# Altium schematic sheet Rail_1.SchDoc: Half Bridge 1
size A4; DocumentNumber: 3; Revision: 1.1; SheetNumber: 3; SheetTotal: 6
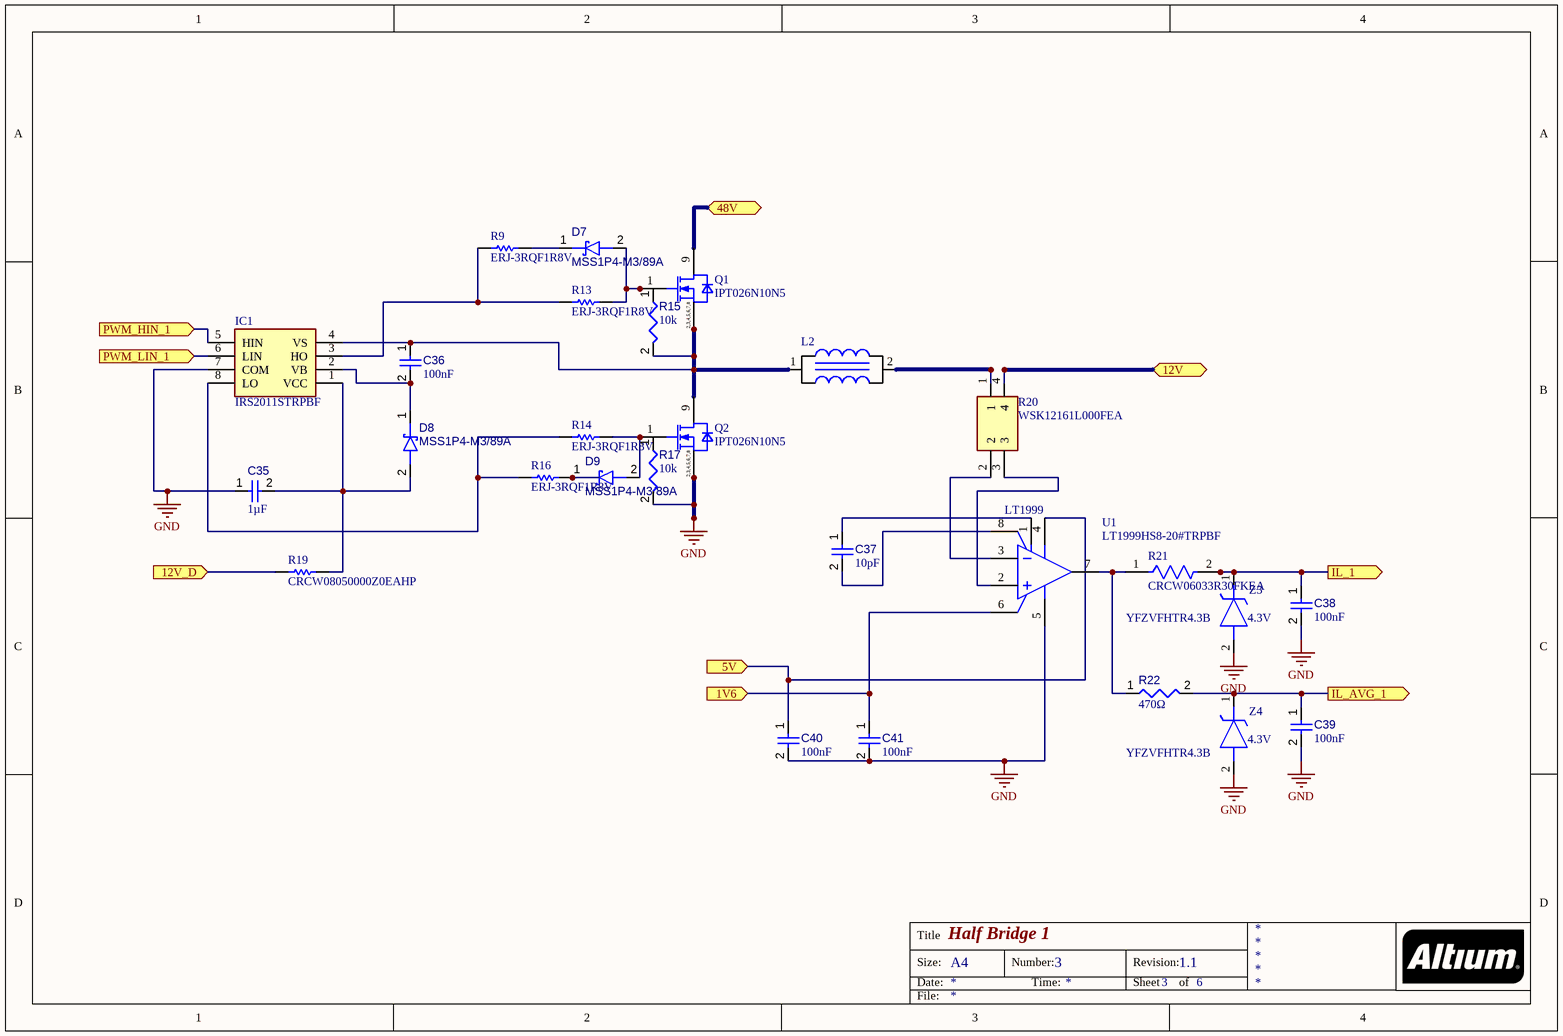
[diagram p0: Rail_1.SchDoc]

## Parts
C35  value 1µF  [CAPC0603(1608)100_L]  (hidden comment: Capacitor 1µF +/-0.1% 25V 0603)
C36  value 100nF  [CAPC1608X90X40ML10T20]  (hidden comment: Capacitor 100 nF +/-10% 50 V 0603)
C37  value 10pF  [CAPC1608X87X35ML15T15]  (hidden comment: Capacitor 10 pF +/- 0.25 pF 50 V 0603)
C38  value 100nF  [CAPC1608X90X40ML10T20]  (hidden comment: Capacitor 100 nF +/-10% 50 V 0603)
C39  value 100nF  [CAPC1608X90X40ML10T20]  (hidden comment: Capacitor 100 nF +/-10% 50 V 0603)
C40  value 100nF  [CAPC1608X90X40ML10T20]  (hidden comment: Capacitor 100 nF +/-10% 50 V 0603)
C41  value 100nF  [CAPC1608X90X40ML10T20]  (hidden comment: Capacitor 100 nF +/-10% 50 V 0603)
D7  MSS1P4-M3/89A  [MicroSMP (DO-219AD)]
D8  MSS1P4-M3/89A  [MicroSMP (DO-219AD)]
D9  MSS1P4-M3/89A  [MicroSMP (DO-219AD)]
IC1  IRS2011STRPBF  [SOIC127P600X175-8N-12-V]
L2  Inductor (Ansys)  [Inductor-Footprint-1]  (value not drawn)
Q1  IPT026N10N5  [INF-PG-HSOF-8-1-0-V]
Q2  IPT026N10N5  [INF-PG-HSOF-8-1-0-V]
R9  ERJ-3RQF1R8V  [RESC1608X55X30LL15T15]
R13  ERJ-3RQF1R8V  [RESC1608X55X30LL15T15]
R14  ERJ-3RQF1R8V  [RESC1608X55X30LL15T15]
R15  value 10k  [RESC1608X55X25ML10T15]  (hidden comment: Resistor 10k +/-1% 0603 100 mW)
R16  ERJ-3RQF1R8V  [RESC1608X55X30LL15T15]
R17  value 10k  [RESC1608X55X25ML10T15]  (hidden comment: Resistor 10k +/-1% 0603 100 mW)
R19  CRCW08050000Z0EAHP  [RESC2013X50X30ML20T20]
R20  WSK12161L000FEA  [WSK12161L000FEA]
R21  CRCW06033R30FKEA  [FP-CRCW0603-e3-IPC_C]
R22  value 470Ω  [RESC0805(2012)_L]  (hidden comment: 470R5J)
U1  LT1999HS8-20#TRPBF  [LT-S8-8_L]
Z3  YFZVFHTR4.3B  [YFZVFHTR43B]
Z4  YFZVFHTR4.3B  [YFZVFHTR43B]

## Ports
1V6 (in), 5V (in), 12V (bidir), 12V_D (in), 48V (bidir), IL_1 (out), IL_AVG_1 (out), PWM_HIN_1 (in), PWM_LIN_1 (in)

## Nets
GND: C35.1 C38.2 C39.2 C40.2 C41.2 IC1.7(COM) Q2.2(SOURCE) Q2.3(SOURCE) Q2.4(SOURCE) Q2.5(SOURCE) Q2.6(SOURCE) Q2.7(SOURCE) Q2.8(SOURCE) R17.2 U1.5(GND) Z3.2(A) Z4.2(A)
1V6: C41.1 U1.6(REF) ; port 1V6
5V: C40.1 U1.4(V+) ; port 5V
12V: R20.4 ; port 12V
12V_D: R19.1 ; port 12V_D
48V: Q1.9(DRAIN) ; port 48V
IL_1: C38.1 R21.2 Z3.1(K) ; port IL_1
IL_AVG_1: C39.1 R22.2 Z4.1(K) ; port IL_AVG_1
PWM_HIN_1: IC1.5(HIN) ; port PWM_HIN_1
PWM_LIN_1: IC1.6(LIN) ; port PWM_LIN_1
NetC35_2: C35.2 D8.2(A) IC1.1(VCC) R19.2
NetC36_1: C36.1 IC1.4(VS) L2.1 Q1.2(SOURCE) Q1.3(SOURCE) Q1.4(SOURCE) Q1.5(SOURCE) Q1.6(SOURCE) Q1.7(SOURCE) Q1.8(SOURCE) Q2.9(DRAIN) R15.2
NetC36_2: C36.2 D8.1(K) IC1.2(VB)
NetC37_1: C37.1 U1.1(V+)
NetC37_2: C37.2 U1.8(~{SHDN})
NetD7_1: D7.1(K) R9.2
NetD7_2: D7.2(A) Q1.1(GATE) R13.2 R15.1
NetD9_1: D9.1(K) R16.2
NetD9_2: D9.2(A) Q2.1(GATE) R14.2 R17.1
NetIC1_3: IC1.3(HO) R9.1 R13.1
NetIC1_8: IC1.8(LO) R14.1 R16.1
NetL2_2: L2.2 R20.1
NetR20_2: R20.2 U1.3(-IN)
NetR20_3: R20.3 U1.2(+IN)
NetR21_1: R21.1 R22.1 U1.7(OUT)

## Notes on the sheet
- (near U1) LT1999
- (near Z3) 4.3V
- (near Z4) 4.3V
- Title
- Size:
- Date:
- A4
- Number:
- Time:
- Revision:
- Sheet
- of
- File:
- (in symbol IPT026N10N5) 2,3,4,5,6,7,8

## Library data of the parts
C35 = CMP-001-00055-2: Chip Capacitor, 1µF +/-0.1%, 25V, 0603, Thickness 1 mm; Tolerance: 20%; Max Operating Temperature: 85°C; Voltage Rating: 25V; Min Operating Temperature: -55°C; Case/Package: 0603; Mounting Technology: SMT; Pins: 2
C36 C38-C41 = CMP-001-00017-4: Chip Capacitor, 100 nF, +/- 10%, 50 V, 0603 (1608 Metric); Capacitor Type: Ceramic; Voltage Rating: 50V; RoHS Compliant: True; Max Operating Temperature: 125°C; Pins: 2; Mounting Technology: SM; Min Operating Temperature: -55°C; Tolerance: 10%; Case/Package: 0603
C37 = CMP-001-00012-4: Chip Capacitor, 10 pF, +/- 0.25 pF, 50 V, 0603 (1608 Metric); Tolerance: 0.25%; Capacitor Type: Ceramic; Voltage Rating: 50V; Min Operating Temperature: -55°C; Mounting Technology: SM; RoHS Compliant: True; Case/Package: 0603; Pins: 2; Max Operating Temperature: 125°C
D7-D9 = CMP-004-00024-2: Schottky Diodes & Rectifiers 1.0 Amp 40 Volt; Max Surge Current: 25A; Forward Voltage: 460mV; Pins: 2; Min Operating Temperature: -55°C; Max Operating Temperature: 150°C; Mounting Technology: SMT
IC1 = IRS2011STRPBF: Integrated Circuit; Manufacturer_Name: Infineon; Datasheet Link: https://componentsearchengine.com/Datasheets/1/IRS2011STRPBF.pdf; Height: 1.75mm; Manufacturer_Part_Number: IRS2011STRPBF; Arrow Part Number: IRS2011STRPBF; Arrow Price/Stock: https://www.arrow.com/en/products/irs2011strpbf/infineon-technologies-ag; Mouser Part Number: 942-IRS2011STRPBF; Mouser Price/Stock: https://www.mouser.co.uk/ProductDetail/Infineon-IR/IRS2011STRPBF?qs=9%252BKlkBgLFf3Y4ge8A0TwYQ%3D%3D
L2 = CMP-006-00021-3: Ansys 3D Model
Q1 Q2 = IPT026N10N5: Insulated-Gate Field-Effect Transistor (IGFET), N-Channel, Enhancement, Body Diode, Pin 1 Gate, 2-8 Source, 9 Drain, 9 Pins; Manufacturer: Infineon Technologies; PackageReference: PG-HSOF-8-1; ManufacturerPartNumber: IPT026N10N5
R9 R13 R14 R16 = CMP-2000-00844-1: Manufacturer: Panasonic; Part Number: ERJ-3RQF1R8V
R15 R17 = CMP-009-00017-4: Chip Resistor, 10 KOhm, +/- 1%, 01 W, -55 to 155 degC, 0603 (1608 Metric); Voltage Rating: 50V; Power: 100mW; Min Operating Temperature: -55°C; Tolerance: 1%; Case/Package: 0603; Pins: 2; Max Operating Temperature: 155°C; RoHS Compliant: True; Mounting Technology: SM
R19 = CMP-2001-04185-1: Manufacturer: Vishay Dale; Part Number: CRCW08050000Z0EAHP
R20 = WSK12161L000FEA: Resistor; Manufacturer_Name: Vishay; Datasheet Link: http://www.vishay.com/docs/30189/wsk1216.pdf; Height: 1.9mm; Manufacturer_Part_Number: WSK12161L000FEA; Arrow Part Number: WSK12161L000FEA; Arrow Price/Stock: https://www.arrow.com/en/products/wsk12161l000fea/vishay; Mouser Part Number: 71-WSK12161L000FEA; Mouser Price/Stock: https://www.mouser.co.uk/ProductDetail/Vishay-Dale/WSK12161L000FEA?qs=jj7GbYRQuOayzWPPW7c8og%3D%3D
R21 = CMP-1012-00228-3: RES Thick Film, 3.3Ω, 1%, 0.1W, 100ppm/°C, 0603; Resistance: 3.3R; Max Power Dissipation: 100mW; Voltage Rating: 75V; Case Code (Imperial): 0603; Width: 0.85mm; Number of Terminations: 2; REACH SVHC: No SVHC; Case/Package: 0603; Package Quantity: 10; Radiation Hardening: No; Min Operating Temperature: -55°C; Max Operating Temperature: 155°C; Composition: Thick Film; Termination: SMD/SMT; Tolerance: 1%; Military Standard: Not; Weight: 7.1E-05oz; Contact Plating: Tin; Packaging: Tape and Reel; Power Rating: 100mW; Height: 0.02inch; Length: 1.55mm; Voltage Rating (DC): 75V; Temperature Coefficient: 100ppm/°C; Case Code (Metric): 1608; Depth: 0.85mm; Lead Free: Lead Free; Features: Automotive AEC-Q200
R22 = CMP-009-00102-1: 470R 0.125W 5% 0805 (2012 Metric)  SMD; Power: 0.125W; Tolerance: 5%; Mounting Technology: SMT; Case/Package: 0805; Pins: 2
U1 = CMP-0359-03344-2: Single Channel, High Voltage, Bidirectional Current Sense Amplifier, 2 MHz Typical GBW, 3 V/us Typical SR, 4.5 to 5.5 V, 8-Pin SOIC (S8-8), High Temperature / Automotive, Pb-Free, Reel; Linear Technology Part Number: LT1999-20; Manufacturer: Linear Technology; Channels (#): 1; GBW (MHz) Typical: 2; Is (mA) Typical: 1.55; Vs Max (V): 5.5; SR (V/us) Typical: 3; Vos (mV) Typical: 0.5; Vs Min (V): 4.5; ComponentLink2Description: Datasheet; RoHS: Pb-Free; ComponentLink1URL: http://www.linear.com/; Type: CSA; DatasheetVersion: Rev. B; ComponentLink3URL: http://cds.linear.com/docs/en/packaging/05081610_G_SO8.pdf; ComponentLink1Description: Manufacturer URL; PackageReference: LT-S8-8; PackageVersion: Rev G; PartNumber: LT1999HS8-20#TRPBF; RevisionNote: URLs updated; Packing: Reel; PackageDescription: 8-Pin Plastic Small Outline, Body 4.9 x 3.9 mm, Pitch 1.27 mm; ComponentLink3Description: Package Specification; Mounting Technology: Surface Mount; ComponentLink2URL: http://cds.linear.com/docs/en/datasheet/1999fb.pdf
Z3 Z4 = YFZVFHTR4.3B: Zener Diode; Manufacturer_Name: ROHM Semiconductor; Datasheet Link: https://componentsearchengine.com/Datasheets/2/YFZVFHTR4.3B.pdf; Height: 0.8mm; Manufacturer_Part_Number: YFZVFHTR4.3B; Mouser Part Number: 755-YFZVFHTR4.3B; Mouser Price/Stock: https://www.mouser.co.uk/ProductDetail/ROHM-Semiconductor/YFZVFHTR43B?qs=4v%252BiZTmLVHGVnMzHBrJLew%3D%3D